# EAGLE design MySens-easyESP32b-007 (EAGLE 9.0.1)
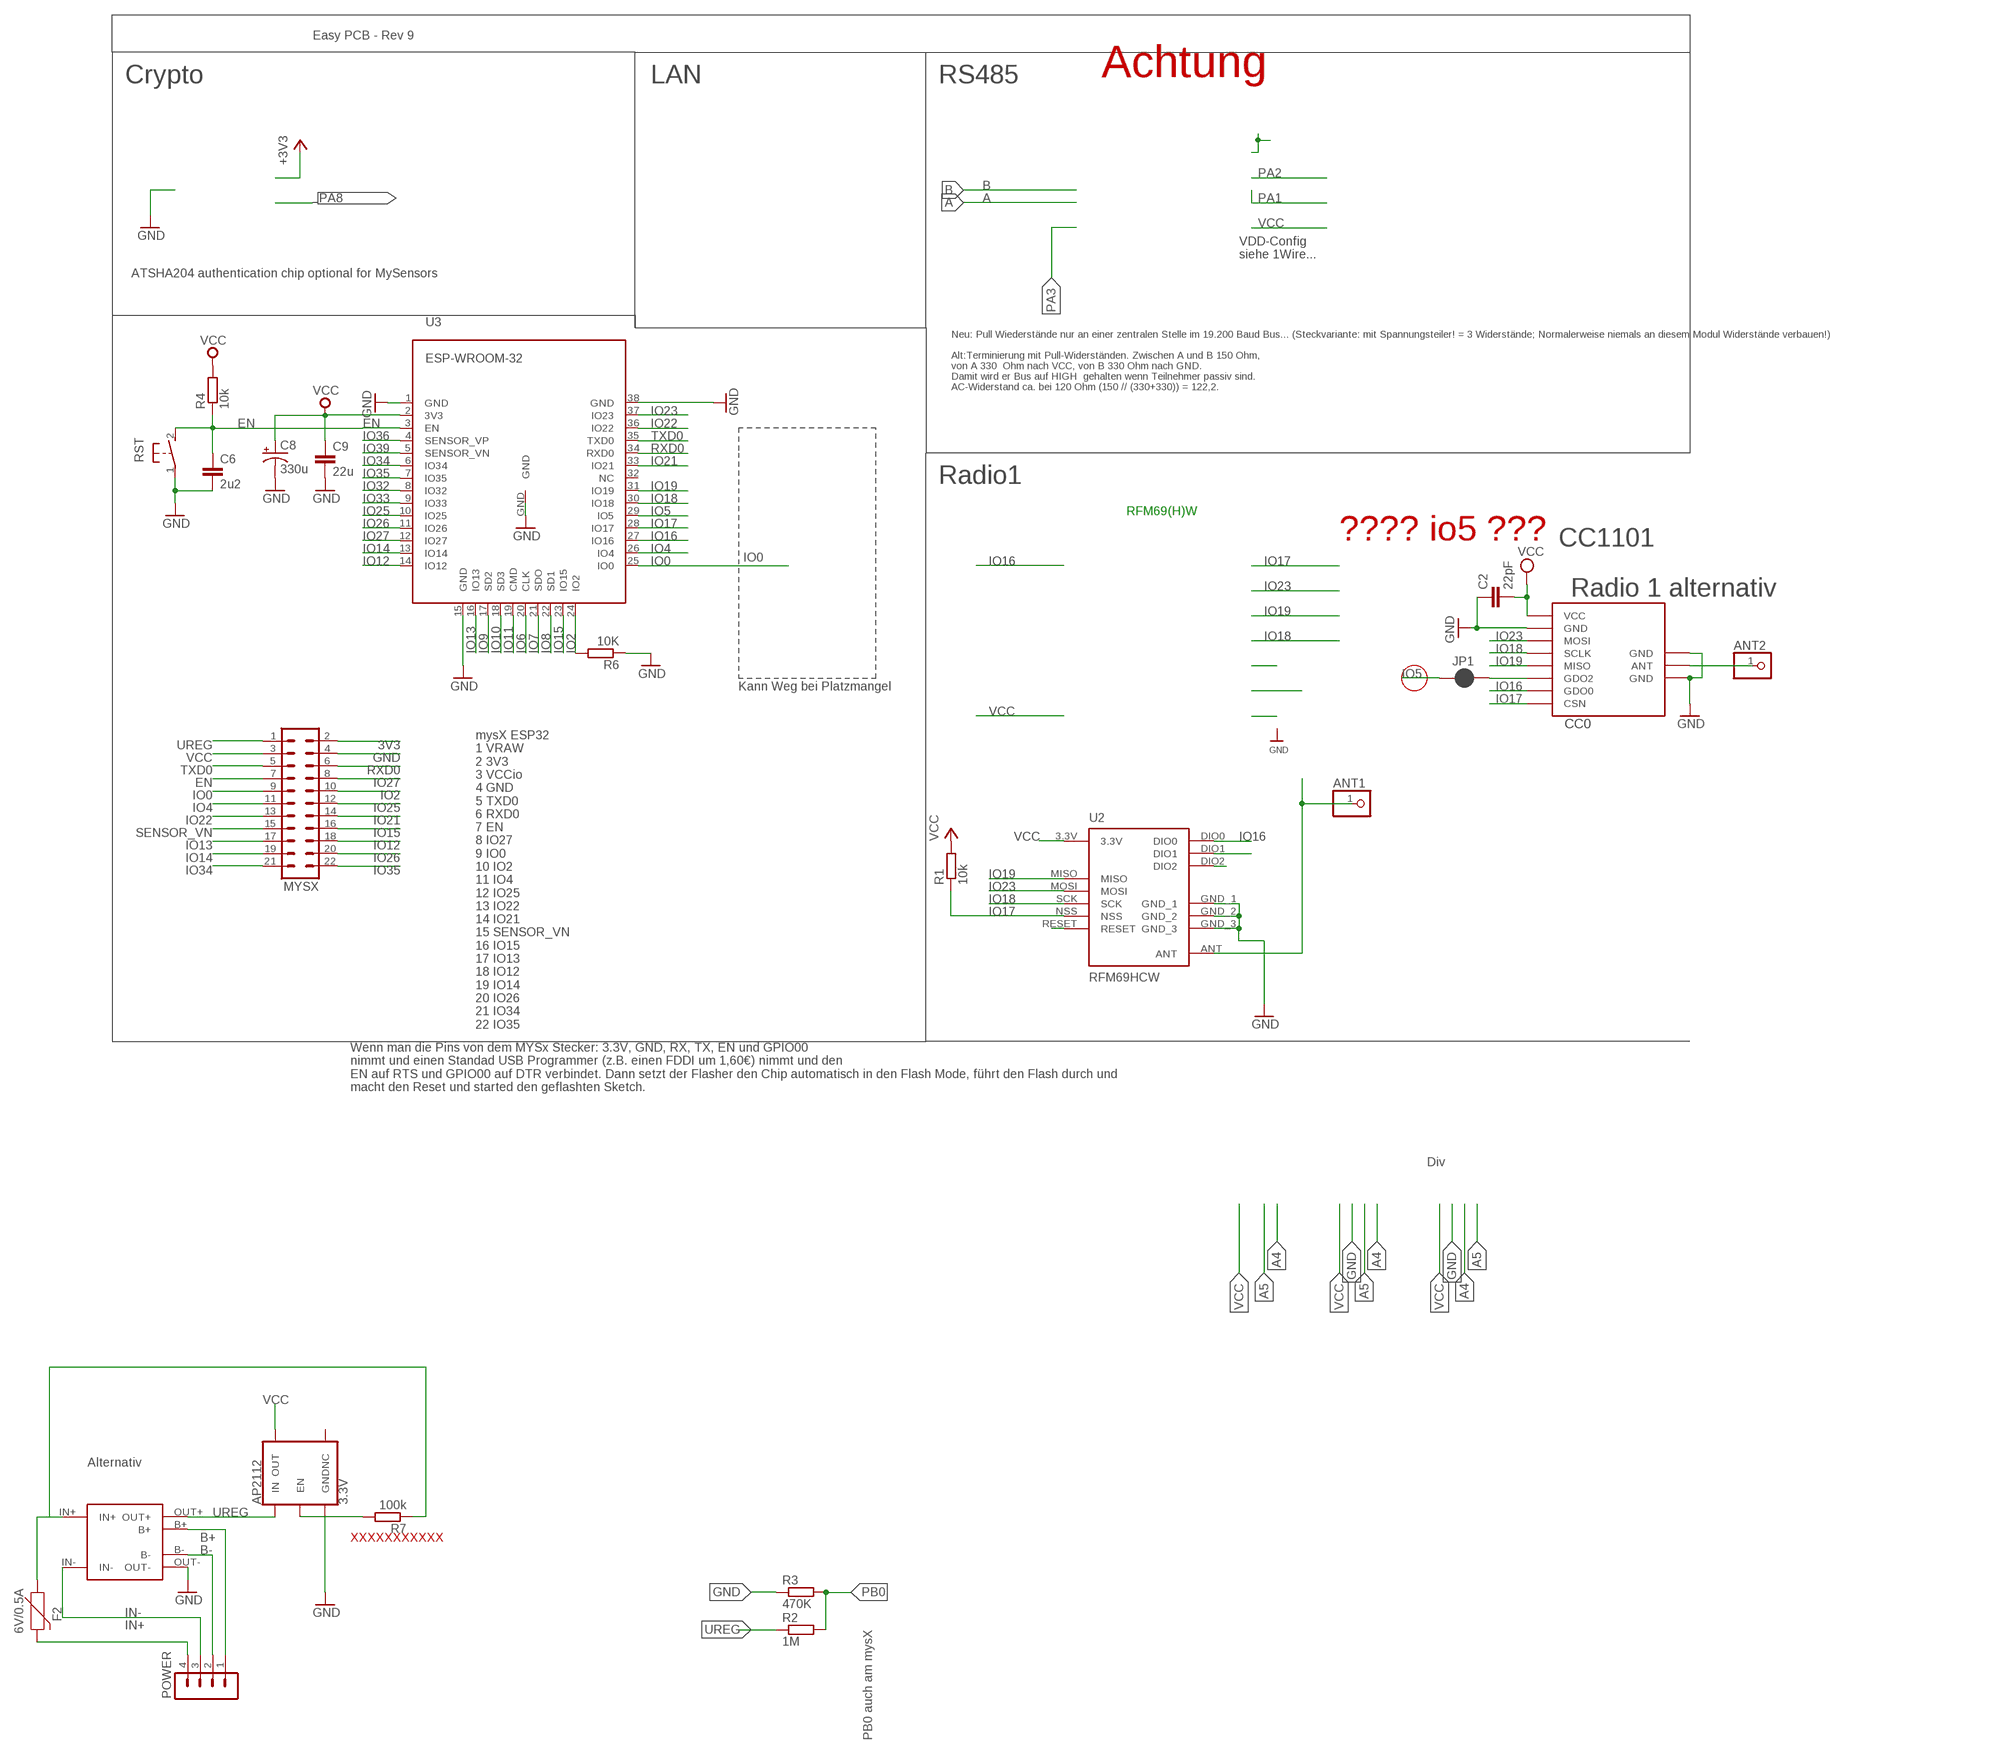
[diagram p0: schematic, sheet 1]

## Parts
ANT1  PINHD-1X1  [1X01]
ANT2  PINHD-1X1  [1X01]
AP2112  3.3V  V_REG_AP2112K-3.3V  [SOT23-5]
C2  22pF  C-EUC0805  [C0805]
C6  2u2  C-EUC0805  [C0805]
C8  330u  CAP_POLSMD  [VISHAY_C]
C9  22u  C-EUC0805  [C0805]
CC0  CC1101  CC1101_MODULE1SMD  [CC1101_MODULE1_SMD]
F2  6V/0.5A  PPTC_HALF-AMP  [1206]
JP1  JUMPER-SMT_2_NC_PASTE_NO-SILK  [SMT-JUMPER_2_NC_PASTE_NO-SILK]
MYSX  MA11-2  [MA11-2]
POWER  MA04-1  [MA04-1]
R1  10k  R-EU_M0805  [M0805]
R2  1M  R-EU_M0805  [M0805]
R3  470K  R-EU_M0805  [M0805]
R4  10k  R-EU_M0805  [M0805]
R6  10K  R-EU_M0805  [M0805]
R7  100k  R-EU_M0805  [M0805]
RST  DTSM-3  [DTSM-3]
TP4056  TP4056-MODULE  [TP4056-LITHIUM-PROTECTED-MODULE]
U2  RFM69HCW  [RFM69HCW-XXXS2]
U3  ESP-WROOM-32  [ESP-WROOM-32]

## Nets
3V3: MYSX.2 ; supply symbol labelled +3V3
ANT0: ANT2.1 CC0.ANT
ANT1: ANT1.1 U2.ANT
B+ [vcc]: POWER.1 TP4056.B+
B- [gnd]: POWER.2 TP4056.B-
EN: C6.1 MYSX.7 R4.1 RST.2 U3.3(EN)
GND [gnd]: AP2112.2(GND) C2.1 C6.2 C8.- C9.2 CC0.GND@0(GND) CC0.GND@1(GND) CC0.GND@2(GND) MYSX.4 R3.1 R6.1 RST.1 TP4056.OUT- U2.GND_1 U2.GND_2 U2.GND_3 U3.1(GND) U3.15(GND) U3.38(GND) U3.GND
IN+ [vcc]: F2.2 POWER.4
IN++ [vcc]: F2.1 R7.1 TP4056.IN+
IN- [gnd]: POWER.3 TP4056.IN-
IO0: MYSX.9 U3.25(IO0)
IO2: MYSX.10 R6.2 U3.24(IO2)
IO4: MYSX.11 U3.26(IO4)
IO5: JP1.1 U3.29(IO5)
IO6: U3.20(CLK)
IO7: U3.21(SDO)
IO8: U3.22(SD1)
IO9: U3.17(SD2)
IO10: U3.18(SD3)
IO11: U3.19(CMD)
IO12: MYSX.18 U3.14(IO12)
IO13: MYSX.17 U3.16(IO13)
IO14: MYSX.19 U3.13(IO14)
IO15: MYSX.16 U3.23(IO15)
IO16: CC0.GDO0 U2.DIO0 U3.27(IO16)
IO17: CC0.CSN R1.1 U2.NSS U3.28(IO17)
IO18: CC0.SCLK U2.SCK U3.30(IO18)
IO19: CC0.MISO U2.MISO U3.31(IO19)
IO21: MYSX.14 U3.33(IO21)
IO22: MYSX.13 U3.36(IO22)
IO23: CC0.MOSI U2.MOSI U3.37(IO23)
IO25: MYSX.12 U3.10(IO25)
IO26: MYSX.20 U3.11(IO26)
IO27: MYSX.8 U3.12(IO27)
IO32: U3.8(IO32)
IO33: U3.9(IO33)
IO34: MYSX.21 U3.6(IO34)
IO35: MYSX.22 U3.7(IO35)
IO36: U3.4(SENSOR_VP)
IO39: U3.5(SENSOR_VN)
MAYBE_IO5: CC0.GDO2 JP1.2
N$4: U2.DIO2
N$8: U2.DIO1
N$9: U2.RESET
N$12: AP2112.3(EN) R7.2
PB0: R2.2 R3.2
RXD0: MYSX.6 U3.34(RXD0)
SENSOR_VN: MYSX.15
TXD0: MYSX.5 U3.35(TXD0)
UREG [gnd]: AP2112.1(IN) MYSX.1 R2.1 TP4056.OUT+
VCC [gnd]: AP2112.5(OUT) C2.2 C8.+ C9.1 CC0.VCC MYSX.3 R1.2 R4.2 U2.3.3V U3.2(3V3)
Unconnected: AP2112.4(NC) U3.32(NC)

## Notes on the sheet
- Easy PCB - Rev 9
- Crypto | LAN | RS485 | Achtung
- VDD-Config
  siehe 1Wire...
- ATSHA204 authentication chip optional for MySensors
- Neu: Pull Wiederstände nur an einer zentralen Stelle im 19.200 Baud Bus... (Steckvariante: mit Spannungsteiler! = 3 Widerstände; Normalerweise niemals an diesem Modul Widerstände verbauen!)
  
  Alt:Terminierung mit Pull-Widerständen. Zwischen A und B 150 Ohm,
  von A 330  Ohm nach VCC, von B 330 Ohm nach GND. 
  Damit wird er Bus auf HIGH  gehalten wenn Teilnehmer passiv sind.
  AC-Widerstand ca. bei 120 Ohm (150 // (330+330)) = 122,2.
- Radio1
- RFM69(H)W
- ???? io5 ??? | CC1101
- Radio 1 alternativ
- Kann Weg bei Platzmangel
- mysX ESP32
  1 VRAW
  2 3V3
  3 VCCio
  4 GND
  5 TXD0
  6 RXD0
  7 EN
  8 IO27
  9 IO0
  10 IO2
  11 IO4
  12 IO25
  13 IO22
  14 IO21
  15 SENSOR_VN
  16 IO15
  17 IO13
  18 IO12
  19 IO14
  20 IO26
  21 IO34
  22 IO35
- Wenn man die Pins von dem MYSx Stecker: 3.3V, GND, RX, TX, EN und GPIO00
  nimmt und einen Standad USB Programmer (z.B. einen FDDI um 1,60€) nimmt und den
  EN auf RTS und GPIO00 auf DTR verbindet. Dann setzt der Flasher den Chip automatisch in den Flash Mode, führt den Flash durch und
  macht den Reset und started den geflashten Sketch.
- Div
- Alternativ
- XXXXXXXXXXX
- PB0 auch am mysX

## Library data of the parts
ANT1 ANT2 = pinhead:PINHD-1X1: PIN HEADER
AP2112 = SparkFun-IC-Power:V_REG_AP2112: AP2112 - 600mA CMOS LDO Regulator w/ Enable The AP2112 is CMOS process low dropout linear regulator with enable function, the regulator delivers a guaranteed 600mA (min.) continuous load current. Features Output Voltage Accuracy: ±1.5% Output Current: 600mA (Min.) Foldback Short Current Protection: 50mA Enable Function to Turn ON/OFF VOUT Low Dropout Voltage (3.3V): 250mV (Typ.) @IOUT=600mA Excellent Load Regulation: 0.2%/A (Typ.) Excellent Line Regulation: 0.02%/V (Typ.) Low Quiescent Current: 55μA (Typ.) Low Standby Current: 0.01μA (Typ.) Low Output Noise: 50μVRMS PSRR: 100Hz -65dB, 1kHz -65dB OTSD Protection Stable with 1.0μF Flexible Cap: Ceramic, Tantalum and Aluminum Electrolytic Operation Temperature Range: -40°C to 85°C ESD: MM 400V, HBM 4000V; PROD_ID: VREG-12457
C2 = rcl:C-EU: CAPACITOR, European symbol
C6 C9 = rcl@1:C-EU: CAPACITOR, European symbol; SPICEPREFIX: C
C8 = SparkFun-Passives:CAP_POL: Capacitor Polarized These are standard SMD and PTH capacitors. Normally 10uF, 47uF, and 100uF in electrolytic and tantalum varieties. Always verify the external diameter of the through hole cap, it varies with capacity, voltage, and manufacturer. The EIA devices should be standard.
CC0 = wireless:CC1101_MODULE1: CC1101 wireless module for 433/868 MHz (sold from Aliexpress). DIL version for mounting with pin header (and SMD soldering) and SMD only variant available.
F2 = SparkFun-Fuses:PPTC: Resettable Fuse PPTC Resettable Fuse. Really a sort of resistor with a polymeric positive temperature coefficient whose resistance increases dramatically with an increase in temperature. When heated by the power passing through the resistance rises causing the current to be limited, protecting the circuit. This is achieved by the transition of the polymer from a crystalline to an amorphous state where the conductive carbon separates breaking the conductive pathways found in the cool crystalline structure. When a PPTC cools back down it resumes conducting letting the circuit turn back on. SparkFun Products: SparkFun RedBoard - Programmed with Arduino <https://www.sparkfun.com/products/12757> Pro Micro - 5V/16MHz <https://www.sparkfun.com/products/12640> Arduino Pro 328 - 5V/16MHz <https://www.sparkfun.com/products/10915> MP3 Trigger <https://www.sparkfun.com/products/13720>; PROD_ID: RES-08585
JP1 = SparkFun-Jumpers:JUMPER-SMT_2_NC_PASTE: Normally closed solder jumper This jumper has an aperture in the stencil to allow solder paste to bridge the split in the wire so it's normally closed (NC). Wick off the solder to open the connection. Reapply solder to reclose the connection.
MYSX = con-Pinheader:MA11-2: PIN HEADER; OC_FARNELL: unknown; OC_NEWARK: unknown
POWER = con-lstb:MA04-1: PIN HEADER; OC_FARNELL: unknown; OC_NEWARK: unknown
R1-R3 R6 R7 = rcl:R-EU_: RESISTOR, European symbol
R4 = rcl@1:R-EU_: RESISTOR, European symbol; SPICEPREFIX: R
RST = switch-tact:DTSM-3
TP4056 = tp2112-usw-V2:TP4056-MODULE
U2 = doug:RFM69H
U3 = esp32:ESP-WROOM-32

## Net classes
0 default: width 0.305 mm, clearance 0.205 mm
1 gnd: width 0.457 mm, drill 0.635 mm, clearance 0.254 mm
2 vcc: width 0.406 mm, drill 0.406 mm, clearance 0.254 mm

## Board
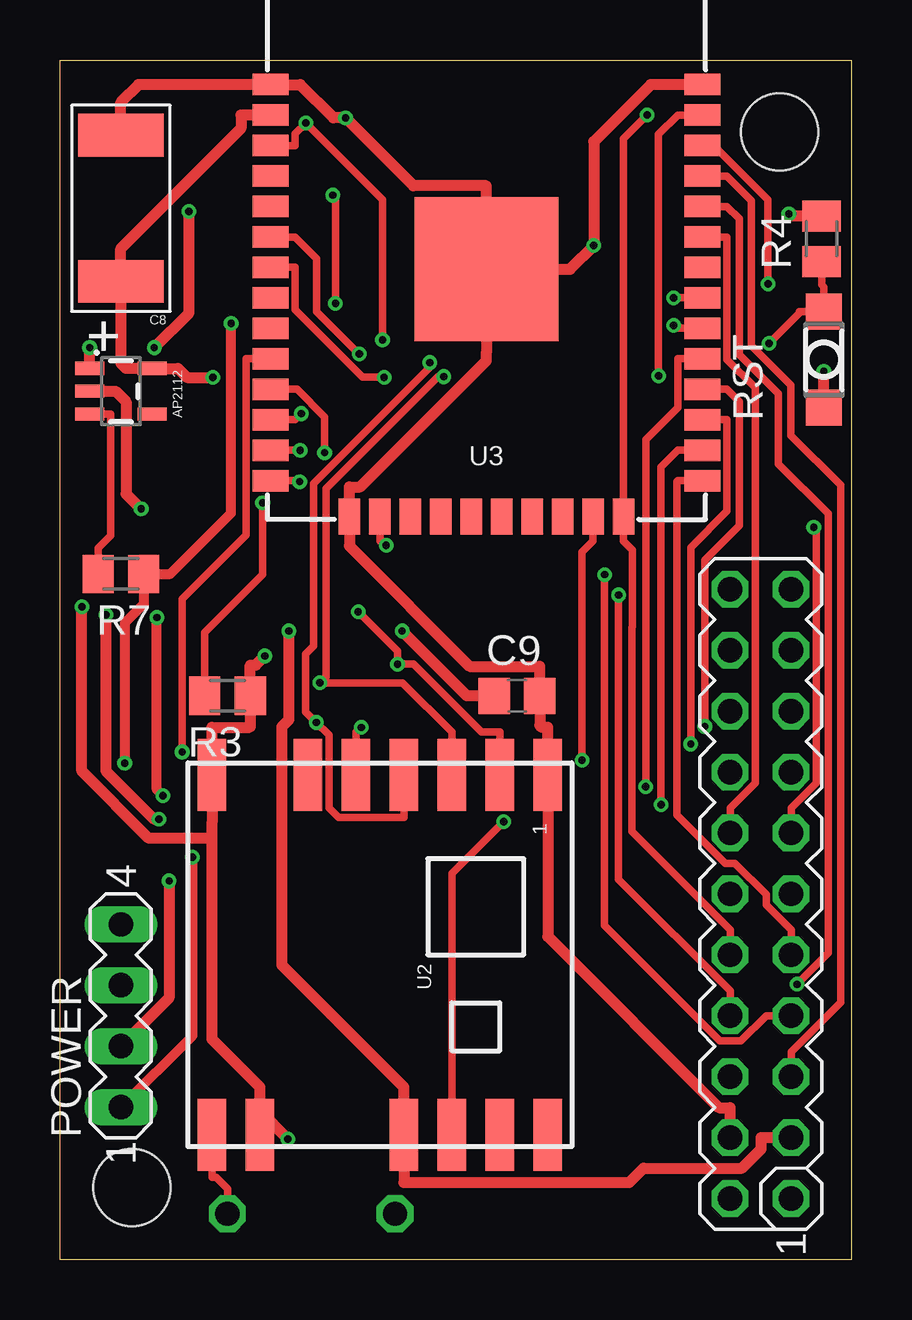
[diagram p1: board, top side]
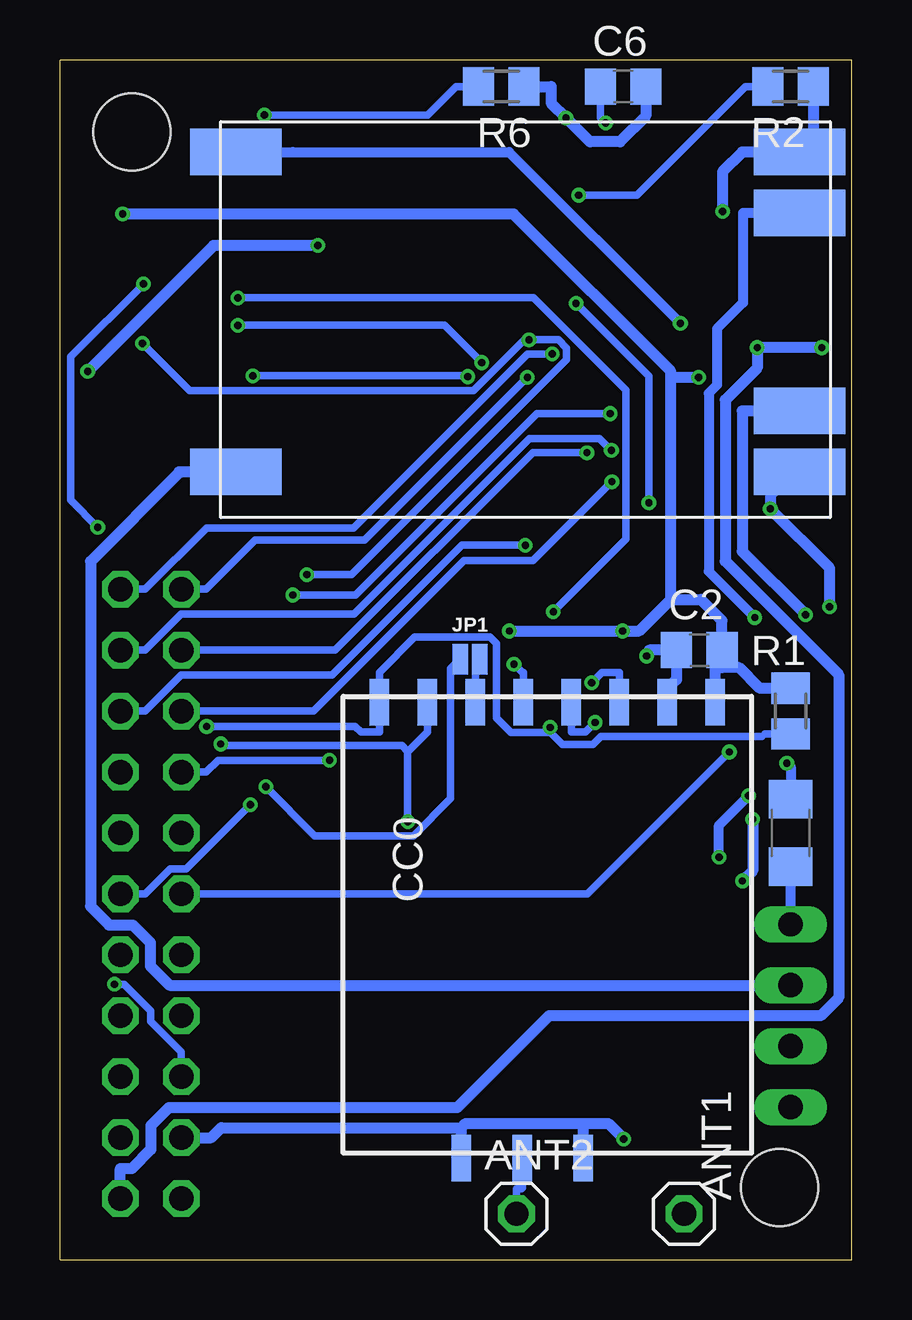
[diagram p2: board, bottom side, seen from below]

Size 33 x 50 mm. Coordinates in mm from the lower left corner, seen from the top.
Outline: 0,0 0,50 33,50 33,0 0,0
Copper layers (1*16): Top 0.035mm / dielectric 1.5mm / Bottom 0.035mm
Design rules "dirt_cheap_dirty_boards.v1": minimum track width 5mil, minimum drill 12mil, track to track 5mil, track to pad 5mil, pad to pad 5mil, via to via 5mil, smd to smd 0mil, copper to edge 10mil, drill to drill 10mil, minimum pad ring 10mil, minimum via ring 6mil, stop-mask expansion 2mil, vias tented up to drill 25mil, thermal gap 10mil
Holes 3.2 mm at 3,3 30,47

### Footprints (pad centres in the part's own frame; a part is rotated, then mirrored left to right if it is on the bottom)
1X01 = drill 1.016 octagon: 1 0,0
SOT23-5 = smd 0.55 x 1.2: 1 -0.95,-1.3; 2 0,-1.3; 3 0.95,-1.3; 4 0.95,1.3; 5 -0.95,1.3
C0805 = smd 1.3 x 1.5: 1 -0.95,0; 2 0.95,0
VISHAY_C = smd 3.556 x 1.778: + 0,3.048; - 0,-3.048
CC1101_MODULE1_SMD = smd 1.93 x 0.813: ANT 19,5.96; CSN 0,0; GDO0 0,2; GDO2 0,4; GND@0 0,12; GND@1 19,8.5; GND@2 19,3.42; MISO 0,6; MOSI 0,10; SCLK 0,8; VCC 0,14
1206 = smd 1.6 x 1.8: 1 -1.4,0; 2 1.4,0
SMT-JUMPER_2_NC_PASTE_NO-SILK = smd 0.635 x 1.27: 1 -0.406,0; 2 0.406,0
MA11-2 = drill 1.016 octagon: 1 -12.7,-1.27; 2 -12.7,1.27; 3 -10.16,-1.27; 4 -10.16,1.27; 5 -7.62,-1.27; 6 -7.62,1.27; 7 -5.08,-1.27; 8 -5.08,1.27; 9 -2.54,-1.27; 10 -2.54,1.27; 11 0,-1.27; 12 0,1.27; 13 2.54,-1.27; 14 2.54,1.27; 15 5.08,-1.27; 16 5.08,1.27; 17 7.62,-1.27; 18 7.62,1.27; 19 10.16,-1.27; 20 10.16,1.27; 21 12.7,-1.27; 22 12.7,1.27
MA04-1 = drill 1.016 long: 1 -3.81,0; 2 -1.27,0; 3 1.27,0; 4 3.81,0
M0805 = smd 1.3 x 1.6: 1 -0.95,0; 2 0.95,0
DTSM-3 = smd 1.5 x 1.5: 1 -2,0; 2 2,0
TP4056-LITHIUM-PROTECTED-MODULE = smd 3.81 x 1.93: B+ 11.43,4.445; B- 11.43,-3.81; IN+ -12.065,6.985; IN- -12.065,-6.35; OUT+ 11.43,6.985; OUT- 11.43,-6.35
RFM69HCW-XXXS2 = smd 3 x 1.2: 3.3V 7.5,1; ANT 7.5,-7; DIO0 7.5,3; DIO1 7.5,5; DIO2 7.5,7; GND_1 7.5,-5; GND_2 -7.5,-7; GND_3 -7.5,7; MISO -7.5,5; MOSI -7.5,3; NSS -7.5,-1; RESET -7.5,-3; SCK -7.5,1
ESP-WROOM-32 = smd 0.9 x 1.5: 1 7.7,9; 2 6.43,9; 3 5.16,9; 4 3.89,9; 5 2.62,9; 6 1.35,9; 7 0.08,9; 8 -1.19,9; 9 -2.46,9; 10 -3.73,9; 11 -5,9; 12 -6.27,9; 13 -7.54,9; 14 -8.81,9; 25 -8.81,-9; 26 -7.54,-9; 27 -6.27,-9; 28 -5,-9; 29 -3.73,-9; 30 -2.46,-9; 31 -1.19,-9; 32 0.08,-9; 33 1.35,-9; 34 2.62,-9; 35 3.89,-9; 36 5.16,-9; 37 6.43,-9; 38 7.7,-9 | smd 1.5 x 0.9: 15 -10.3,5.715; 16 -10.3,4.445; 17 -10.3,3.175; 18 -10.3,1.905; 19 -10.3,0.635; 20 -10.3,-0.635; 21 -10.3,-1.905; 22 -10.3,-3.175; 23 -10.3,-4.445; 24 -10.3,-5.715 | smd 6 x 6: GND 0,0

### Placement (x,y rotation side)
ANT1  6.99,1.91 0 bottom
ANT2  13.97,1.91 0 bottom
AP2112  2.54,36.2 270 top
C2  6.35,25.4 0 bottom
C6  9.53,48.9 0 bottom
C8  2.54,43.81 180 top
C9  19.05,23.5 0 top
CC0  19.68,23.23 270 bottom
F2  2.54,17.78 270 bottom
JP1  15.91,25.02 0 bottom
MYSX  29.21,15.24 90 top
POWER  2.54,10.16 90 top
R1  2.54,22.86 90 bottom
R2  2.54,48.9 180 bottom
R3  6.99,23.5 180 top
R4  31.75,42.55 90 top
R6  14.61,48.9 180 bottom
R7  2.54,28.57 180 top
RST  31.84,37.51 90 top
TP4056  13.6,39.18 0 bottom
U2  13.34,12.7 270 top
U3  17.78,41.27 90 top

### Tracks (layer width: path | path; a pad name or v marks a point on that pad's centre or on a via)
ANT0
  Bottom 0.305: ANT2.1 13.97,2.95 13.76,2.95 13.72,2.98 CC0.ANT
ANT1
  Top 0.305: U2.ANT 6.33,3.42 6.51,3.42 6.99,2.95 ANT1.1
B+  (via drill 0.3 pad 0.61)
  Top 0.406: POWER.1 5.52,9.33 v5.52,16.77 | v4.29,19.34 4.04,19.59 v4.04,26.76
  Bottom 0.406: v5.52,16.77 5.52,18.1 v4.29,19.34 | v4.04,26.76 5.95,28.68 5.95,36.11 5.61,36.45 5.61,38.8 4.53,39.88 4.53,43.62 TP4056.B+
B-  (via drill 0.3 pad 0.61)
  Top 0.457: v4.55,15.78 4.55,10.9 POWER.2 | v1.91,26.88 1.91,20.37 3.93,18.35 v4.12,18.35
  Bottom 0.457: v4.12,18.35 4.12,16.21 v4.55,15.78 | v1.91,26.88 4.55,29.52 4.55,35.37 TP4056.B-
EN  (via drill 0.3 pad 0.61)
  Top 0.305: v22.7,28.55 22.7,13.92 27.51,9.12 28.39,9.12 29.44,10.16 MYSX.7 | v13.45,38.33 13.45,44.19 v10.26,47.38 9.81,46.93 9.81,46.44 U3.3 | v29.56,38.19 30.82,39.44 30.82,39.51 RST.2 31.84,40.02 31.84,40.54 31.75,40.63 31.75,40.67 R4.1
  Bottom 0.305: v22.7,28.55 20.85,28.55 11.89,37.51 11.89,37.99 12.23,38.33 v13.45,38.33 13.64,38.33 15.75,36.22 27.59,36.22 v29.56,38.19 | v10.26,47.38 10.47,47.59 C6.1
GND  (via drill 0.3 pad 0.61)
  Top 0.457: U3.GND 21.26,41.27 21.26,41.28 v22.25,42.27 22.25,46.59 24.63,48.98 U3.38 | RST.1 v31.84,37.02 | v8.54,25.15 8.16,24.78 7.93,24.78 R3.1 7.93,22.85 7.93,22.21 7.91,22.18 6.33,22.18 U2.GND_2 6.33,19.21 6.33,18.22 6.33,17.56 | 6.33,17.56 6.33,9.18 8.34,7.18 8.34,6.19 | 6.33,17.56 3.71,17.56 0.91,20.36 v0.91,27.2 | MYSX.4 27.94,6.33 27.47,6.33 20.34,13.46 U2.GND_3 20.34,20.75 20.34,22.18 20.08,22.18 20,22.26 C9.2 20,24.73 17.08,24.73 12.06,29.74 U3.15 12.06,31.41 12.06,32.21 12.52,32.21 17.78,37.47 17.78,37.79 17.78,40.93 U3.GND | U3.GND 17.78,44.76 14.73,44.76 v11.9,47.59 11.4,47.59 10.01,48.98 U3.1 3.28,48.98 2.54,48.23 C8.- | 8.34,6.19 v9.5,5.03 | U2.GND_1 8.34,6.19 | v3.38,31.29 2.76,31.91 2.76,35.76 2.32,36.2 AP2112.2
  Bottom 0.457: v22.25,42.27 26.59,42.27 v31.84,37.02 | v8.54,25.15 8.43,25.26 8.43,25.4 C2.1 7.3,24.17 7.68,23.78 CC0.GND@0 | v0.91,27.2 0.91,28.81 v3.38,31.29 3.38,31.87 2.43,32.83 TP4056.OUT- | 16.27,5.5 16.09,5.67 11.19,5.67 | 16.27,5.5 26.28,5.5 26.7,5.08 MYSX.4 | 11.19,5.67 10.14,5.67 v9.5,5.03 | CC0.GND@1 11.19,5.67 | R6.1 12.52,48.9 12.52,48.21 v11.9,47.59 10.9,46.59 9.65,46.59 8.57,47.66 C6.2 | CC0.GND@2 16.27,5.5
IN+
  Bottom 0.406: POWER.4 F2.2
IN++  (via drill 0.3 pad 0.61)
  Top 0.406: v7.13,39.02 7.13,31.11 4.6,28.57 R7.1 3.49,27.32 2.7,26.53 v2.7,20.69
  Bottom 0.406: v7.13,39.02 14.28,46.16 23.3,46.16 TP4056.IN+ | v2.7,20.69 2.54,20.53 F2.1
IN-
  Bottom 0.457: POWER.3 28.43,11.43 29.23,12.23 29.23,13.22 29.96,13.95 30.95,13.95 31.73,14.72 31.73,29.1 28.05,32.78 28.05,32.83 TP4056.IN-
IO0
  Top 0.305: MYSX.9 30.48,13.74 29.44,14.78 29.44,15.21 28.14,16.51 27.74,16.51 25.71,18.53 25.71,32.43 25.75,32.47 U3.25
IO2  (via drill 0.3 pad 0.61)
  Top 0.305: MYSX.10 27.94,13.74 23.84,17.84 23.84,26.34 23.87,26.38 23.87,29.57 23.5,29.95 U3.24 23.5,31.49 23.5,32 23.5,46.72 v24.48,47.7
  Bottom 0.305: v24.48,47.7 17.67,47.7 16.48,48.9 R6.2 | v24.48,47.7
IO4  (via drill 0.3 pad 0.61)
  Top 0.305: v25.06,18.96 25.06,33.04 25.75,33.73 U3.26
  Bottom 0.305: v25.06,18.96 27.74,16.28 28.4,16.28 29.44,15.24 MYSX.11
IO5  (via drill 0.3 pad 0.61)
  Top 0.305: v24.42,19.71 24.42,34.18 25.75,35.51 25.75,37.55 U3.29
  Bottom 0.305: JP1.1 16.72,24.63 16.72,19.22 18.27,17.67 22.38,17.67 v24.42,19.71
IO12  (via drill 0.3 pad 0.61)
  Top 0.305: v9.99,32.42 9.95,32.47 9.81,32.47 U3.14
  Bottom 0.305: v9.99,32.42 13.28,29.13 16.15,29.13 22.43,22.86 26.9,22.86 MYSX.18
IO13  (via drill 0.3 pad 0.61)
  Top 0.305: v13.6,29.77 13.43,29.95 13.34,29.95 U3.16
  Bottom 0.305: v13.6,29.77 16.23,29.77 21.65,24.36 27.94,24.36 29.44,22.86 MYSX.17
IO14  (via drill 0.3 pad 0.61)
  Top 0.305: v10.01,33.73 9.82,33.73 9.81,33.73 U3.13
  Bottom 0.305: v10.01,33.73 10.5,34.22 13.43,34.22 20.75,26.9 27.94,26.9 29.44,25.4 MYSX.19
IO15  (via drill 0.3 pad 0.61)
  Top 0.305: v21.76,20.81 21.76,29.48 22.23,29.95 U3.23
  Bottom 0.305: MYSX.16 26.9,20.32 26.41,20.81 v21.76,20.81
IO16  (via drill 0.3 pad 0.61)
  Top 0.305: v26.3,21.49 26.3,29.68 27.81,31.19 27.81,35.01 U3.27 | v18.5,18.25 16.34,16.09 U2.DIO0
  Bottom 0.305: 18.5,21.18 18.75,21.43 26.23,21.43 v26.3,21.49 | 18.5,21.18 v18.5,18.25 | 18.5,21.18 18.48,21.18 17.68,21.98 CC0.GDO0
IO17  (via drill 0.3 pad 0.61)
  Top 0.305: U3.28 27.81,36.27 28.32,35.77 28.32,30.6 26.89,29.17 v26.89,22.22 | U2.NSS 12.34,21.98 12.36,21.98 v12.56,22.18
  Bottom 0.305: v26.89,22.22 20.69,22.22 20.45,21.98 19.68,21.98 CC0.CSN 19.68,24.47 18.21,25.94 15.07,25.94 14.8,25.67 14.8,22.57 14.2,21.98 12.56,21.98 | 12.56,21.98 v12.56,22.18 | 12.56,21.98 12.05,21.47 10.78,21.47 10.45,21.8 3.73,21.8 3.62,21.91 R1.1
IO18  (via drill 0.3 pad 0.61)
  Top 0.305: v15.41,37.39 15.41,37.17 10.57,32.34 10.57,25.57 10.24,25.24 10.24,22.83 v10.69,22.39 11.21,21.86 11.21,18.82 11.61,18.42 14.34,18.42 U2.SCK | U3.30 25.7,38.81 v25.58,38.94
  Bottom 0.305: v25.58,38.94 16.96,38.94 v15.41,37.39 | CC0.SCLK 11.69,21.98 11.09,21.98 v10.69,22.39
IO19  (via drill 0.3 pad 0.61)
  Top 0.305: U3.31 v25.58,40.09 | v12.43,27 14.07,25.36 v14.07,24.82 14.74,24.82 17.58,21.98 18.34,21.98 U2.MISO
  Bottom 0.305: v12.43,27 9.4,30.03 9.4,36.23 13.26,40.09 v25.58,40.09 | CC0.MISO 13.69,24.47 13.73,24.47 v14.07,24.82
IO21
  Top 0.305: MYSX.14 27.94,18.82 28.98,19.86 28.98,36.34 27.81,37.52 27.81,42.62 U3.33
IO22  (via drill 0.3 pad 0.61)
  Top 0.305: v31.43,30.52 31.52,30.42 31.52,19.86 30.48,18.82 MYSX.13 | U3.36 27.26,46.44 29.52,44.18 v29.52,40.67
  Bottom 0.305: v29.52,40.67 32.56,37.63 32.56,31.65 v31.43,30.52
IO23  (via drill 0.3 pad 0.61)
  Top 0.305: v16,36.8 15.76,36.8 11.09,32.13 11.09,24.29 v10.83,24.04 14.28,24.04 16.34,21.98 U2.MOSI | v24.95,36.84 24.95,46.91 25.75,47.7 U3.37
  Bottom 0.305: v24.95,36.84 16.03,36.84 v16,36.8 | CC0.MOSI 9.69,24.47 10.4,24.47 v10.83,24.04
IO25  (via drill 0.3 pad 0.61)
  Top 0.305: U3.10 7.75,37.55 7.75,30.19 5.09,27.54 v5.09,21.16
  Bottom 0.305: MYSX.12 26.9,15.24 11.01,15.24 v5.09,21.16
IO26  (via drill 0.3 pad 0.61)
  Top 0.305: v11.03,33.63 11.03,35.12 9.88,36.27 9.81,36.27 U3.11
  Bottom 0.305: v11.03,33.63 13.29,33.63 21.52,25.4 26.9,25.4 MYSX.20
IO27  (via drill 0.3 pad 0.61)
  Top 0.305: v23.29,27.7 23.29,15.85 27.94,11.2 MYSX.8 | v10.06,35.26 9.81,35.01 U3.12
  Bottom 0.305: v23.29,27.7 20.67,27.7 13.11,35.26 v10.06,35.26
IO34  (via drill 0.3 pad 0.61)
  Top 0.305: v12.47,37.75 10.71,39.52 10.71,41.73 9.81,42.62 U3.6
  Bottom 0.305: v12.47,37.75 13.5,37.75 20.76,30.49 26.89,30.49 29.44,27.94 MYSX.21
IO35  (via drill 0.3 pad 0.61)
  Top 0.305: U3.7 9.81,41.35 9.81,39.59 12.62,36.77 v13.51,36.77
  Bottom 0.305: MYSX.22 26.9,27.94 24.86,29.98 20.31,29.98 v13.51,36.77
MAYBE_IO5
  Bottom 0.305: CC0.GDO2 15.69,24.47 15.5,24.65 JP1.2
N$12
  Top 0.305: R7.2 1.59,29.65 2.12,30.18 2.12,35.24 AP2112.3
PB0  (via drill 0.3 pad 0.61)
  Top 0.305: v11.37,44.37 11.49,44.25 v11.49,39.86 | R3.2 6.04,26.14 8.45,28.56 v8.45,31.54
  Bottom 0.305: v8.45,31.54 8.45,36.82 v11.49,39.86 | R2.2 4.42,48.9 8.95,44.37 v11.37,44.37
RXD0  (via drill 0.3 pad 0.61)
  Top 0.305: v30.73,11.47 32.03,12.78 32.03,31.09 29.95,33.17 29.95,36.09 28.32,37.73 28.32,43.38 27.81,43.9 U3.34
  Bottom 0.305: v30.73,11.47 30.31,11.47 29.21,10.37 29.21,9.93 27.94,8.66 MYSX.6
TXD0
  Top 0.305: MYSX.5 30.48,8.66 32.54,10.72 32.54,32.27 30.46,34.35 30.46,36.45 28.83,38.09 28.83,44.15 27.81,45.16 U3.35
UREG  (via drill 0.3 pad 0.61)
  Top 0.457: v3.93,38.01 5.38,39.46 v5.38,43.69 | AP2112.1 v1.24,38.01
  Bottom 0.457: v5.38,43.69 5.38,45.34 4.55,46.16 TP4056.OUT+ 1.59,46.74 R2.1 | v1.24,38.01 v3.93,38.01 3.93,37.16 5.26,35.83 5.26,29.11 0.53,24.38 0.53,10.91 1.29,10.16 12.61,10.16 16.44,6.33 28.46,6.33 29.21,5.58 29.21,4.58 30.01,3.79 30.48,3.79 MYSX.1
VCC  (via drill 0.3 pad 0.61)
  Top 0.457: R4.2 30.47,43.49 30.47,43.5 v30.39,43.58 | v9.54,26.2 9.54,22.5 9.25,22.21 9.25,12.27 14.34,7.18 U2.3.3V 14.34,4.21 14.34,3.22 23.73,3.22 24.32,3.81 28.43,3.81 29.23,4.61 29.23,5.08 MYSX.3 | U3.2 7.55,47.7 7.55,47.15 2.54,42.14 C8.+ 2.54,37.36 2.76,37.15 3.48,37.15 AP2112.5 4.92,37.15 5.3,36.77 v6.37,36.77 | v14.26,26.2 16.97,23.5 C9.1
  Bottom 0.457: 7.54,36.77 7.54,37.03 14.09,43.58 v30.39,43.58 | 7.54,27.51 7.54,36.77 | v6.37,36.77 7.54,36.77 | 7.54,27.51 8.85,26.2 v9.54,26.2 v14.26,26.2 | 7.54,27.51 6.28,27.51 5.4,26.63 C2.2 5.4,24.67 | 5.4,24.67 5.68,24.67 CC0.VCC | 5.4,24.67 4.68,24.67 3.82,23.81 R1.2

### Text on the board
tNames: easyGW BluePill 0.2 / RS485, RFM69, RFM95 | VCC | GND | SDL | SDA | 5V | UREG | GND | 5V
bNames: PluepillGW V01 / RS485, RFM69, RFM95
Document: DS_1551K